# Altium schematic sheet 02_VI-adc.SchDoc
size A4; Organization: Altium Limited; Address1: L3, 12a Rodborough Rd; Address2: Frenchs Forest; Address3: NSW; Address4: Australia 2086
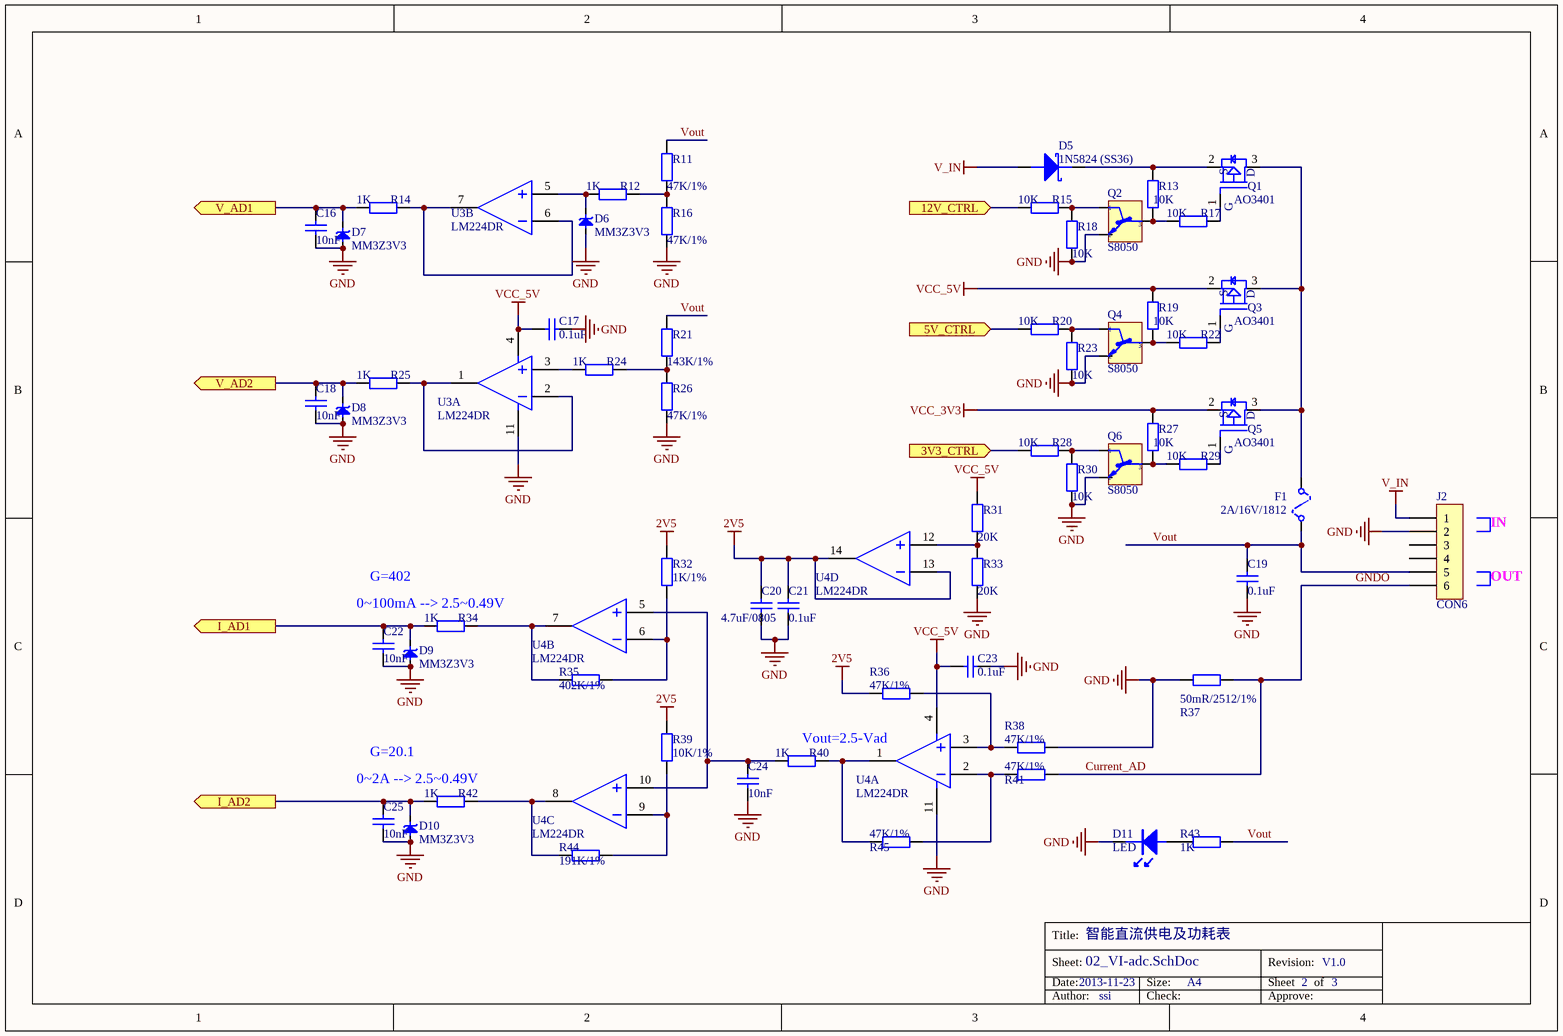
[diagram p0: 02_VI-adc.SchDoc]

## Parts
C16  10nF  [0603C]
C17  0.1uF  [0603C]
C18  10nF  [0603C]
C19  0.1uF  [0603C]
C20  4.7uF/0805  [0805]
C21  0.1uF  [0603C]
C22  10nF  [0603C]
C23  0.1uF  [0603C]
C24  10nF  [0603C]
C25  10nF  [0603C]
D5  1N5824 (SS36)  [SMA/DO-214AC]
D6  MM3Z3V3  [SOD-323]
D7  MM3Z3V3  [SOD-323]
D8  MM3Z3V3  [SOD-323]
D9  MM3Z3V3  [SOD-323]
D10  MM3Z3V3  [SOD-323]
D11  LED  [LED-3.5mm]
F1  2A/16V/1812  [F1812]
J2  CON6  [SIPD6]
Q1  AO3401  [SOT-23]
Q2  S8050  [SOT-23]
Q3  AO3401  [SOT-23]
Q4  S8050  [SOT-23]
Q5  AO3401  [SOT-23]
Q6  S8050  [SOT-23]
R11  47K/1%  [0603]
R12  1K  [0603]
R13  10K  [0603]
R14  1K  [0603]
R15  10K  [0603]
R16  47K/1%  [0603]
R17  10K  [0603]
R18  10K  [0603]
R19  10K  [0603]
R20  10K  [0603]
R21  143K/1%  [0603]
R22  10K  [0603]
R23  10K  [0603]
R24  1K  [0603]
R25  1K  [0603]
R26  47K/1%  [0603]
R27  10K  [0603]
R28  10K  [0603]
R29  10K  [0603]
R30  10K  [0603]
R31  20K  [0603]
R32  1K/1%  [0603]
R33  20K  [0603]
R34  1K  [0603]
R35  402K/1%  [0603]
R36  47K/1%  [0603]
R37  50mR/2512/1%  [2512]
R38  47K/1%  [0603]
R39  10K/1%  [0603]
R40  1K  [0603]
R41  47K/1%  [0603]
R42  1K  [0603]
R43  1K  [0603]
R44  191K/1%  [0603]
R45  47K/1%  [0603]
U3  LM224DR  [SO-14]  (parts A,B of 4)
U4  LM224DR  [SO-14]  (parts A,B,C,D of 4)

## Ports
3V3_CTRL (in), 5V_CTRL (in), 12V_CTRL (in), I_AD1 (out), I_AD2 (out), V_AD1 (out), V_AD2 (out)

## Nets
2V5: C20.2 C21.2 R32.1 R36.1 R39.1 U4.13 U4.14
GND: C16.1 C17.2 C18.1 C19.1 C20.1 C21.1 C22.1 C23.2 C24.1 C25.1 D6.1(A) D7.1(A) D8.1(A) D9.1(A) D10.1(A) D11.2(K) J2.2 Q2.2(E) Q4.2(E) Q6.2(E) R16.1 R18.1 R23.1 R26.1 R30.1 R33.1 R37.1 R38.2 U3.11 U4.11
V_IN: D5.1(A) J2.1
VCC_3V3: Q5.2(S) R27.2
VCC_5V: C17.1 C23.1 Q3.2(S) R19.2 R31.2 U3.4 U4.4
3V3_CTRL: R28.1 ; port 3V3_CTRL
5V_CTRL: R20.1 ; port 5V_CTRL
12V_CTRL: R15.1 ; port 12V_CTRL
Current_AD: J2.6 R37.2 R41.2  [also labelled GNDO]
I_AD1: C22.2 D9.2(K) R34.1 ; port I_AD1
I_AD2: C25.2 D10.2(K) R42.1 ; port I_AD2
V_AD1: C16.2 D7.2(K) R14.1 ; port V_AD1
V_AD2: C18.2 D8.2(K) R25.1 ; port V_AD2
Vout: C19.2 F1.1 J2.5 R11.2 R21.2 R43.2
NetC24_2: C24.2 R40.1 U4.5 U4.10
NetD5_2: D5.2(K) Q1.2(S) R13.2
NetD6_2: D6.2(K) R12.1 U3.5
NetD11_1: D11.1(A) R43.1
NetF1_2: F1.2 Q1.3(D) Q3.3(D) Q5.3(D)
NetQ1_1: Q1.1(G) R17.2
NetQ2_1: Q2.1(B) R15.2 R18.2
NetQ2_3: Q2.3(C) R13.1 R17.1
NetQ3_1: Q3.1(G) R22.2
NetQ4_1: Q4.1(B) R20.2 R23.2
NetQ4_3: Q4.3(C) R19.1 R22.1
NetQ5_1: Q5.1(G) R29.2
NetQ6_1: Q6.1(B) R28.2 R30.2
NetQ6_3: Q6.3(C) R27.1 R29.1
NetR11_1: R11.1 R12.2 R16.2
NetR14_2: R14.2 U3.6 U3.7
NetR21_1: R21.1 R24.2 R26.2
NetR24_1: R24.1 U3.3
NetR25_2: R25.2 U3.1 U3.2
NetR31_1: R31.1 R33.2 U4.12
NetR32_2: R32.2 R35.2 U4.6
NetR34_2: R34.2 R35.1 U4.7
NetR36_2: R36.2 R38.1 U4.3
NetR39_2: R39.2 R44.2 U4.9
NetR40_2: R40.2 R45.1 U4.1
NetR41_1: R41.1 R45.2 U4.2
NetR42_2: R42.2 R44.1 U4.8

Not connected (* = marked no-connect by the designer): J2 3 4

## Notes on the sheet
- G=402
- OUT
- IN
- (near R34) 0~100mA --> 2.5~0.49V
- (near R42) 0~2A --> 2.5~0.49V
- G=20.1
- Vout=2.5-Vad
- 2013-11-23
- 智能直流供电及功耗表
- 2        3
- V1.0
- ssi
- Title:
- Sheet:
- Date:
- Size:
- A4
- Revision:
- Sheet
- of
- Author:
- Check:
- Approve:

## Library data of the parts
C16-C25 = Cap: Capacitor; Published: 8-Jun-2000; LatestRevisionDate: 17-Jul-2002; LatestRevisionNote: Re-released for DXP Platform.; PackageReference: RAD-0.3; Publisher: Altium Limited
D5 = DIODE_1N582x: Schottky Diode
D6-D10 = DIODE_MM3Zxx: Zener Diode; Published: 8-Jun-2000; LatestRevisionDate: 17-Jul-2002; LatestRevisionNote: Re-released for DXP Platform.; PackageReference: DIODE-0.7; Publisher: Altium Limited
F1 = Fuse 3: Fuse; Published: 8-Jun-2000; LatestRevisionDate: 17-Jul-2002; LatestRevisionNote: Re-released for DXP Platform.; PackageReference: PIN-W2/E2.8; Publisher: Altium Limited
Q1 Q3 Q5 = MOS_P_SI2305DS
Q2 Q4 Q6 = NPN_T: NPN
R11-R45 = Res2: Resistor; Published: 8-Jun-2000; LatestRevisionDate: 17-Jul-2002; LatestRevisionNote: Re-released for DXP Platform.; PackageReference: AXIAL-0.4; Publisher: Altium Limited
U3 U4 = LM224